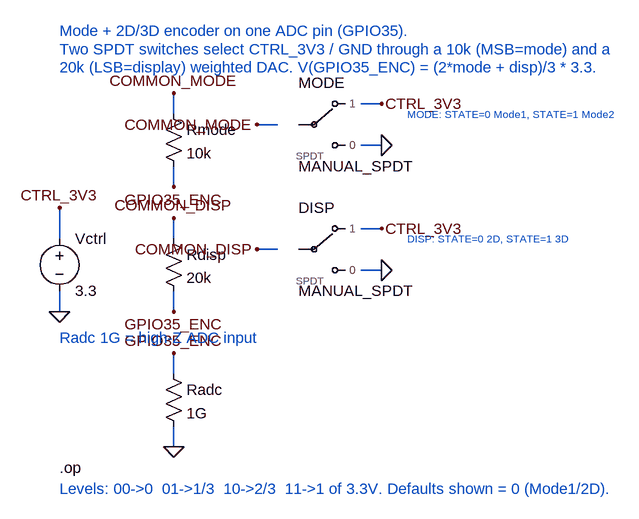
[diagram p0: schematic mode_encoder.asc]
mode_encoder.asc, the LTspice schematic file:
Version 4
SHEET 1 880 760
WIRE -160 160 -160 208
WIRE -160 288 -160 320
WIRE 16 -16 16 16
WIRE 16 96 16 128
WIRE 16 208 16 176
WIRE 16 288 16 320
WIRE 16 416 16 384
WIRE 16 496 16 528
WIRE 144 32 176 32
WIRE 144 224 176 224
WIRE 304 0 336 0
WIRE 304 64 336 64
WIRE 304 192 336 192
WIRE 304 256 336 256
FLAG -160 160 CTRL_3V3
FLAG -160 320 0
FLAG 16 -16 COMMON_MODE
FLAG 16 128 GPIO35_ENC
FLAG 16 176 COMMON_DISP
FLAG 16 320 GPIO35_ENC
FLAG 16 384 GPIO35_ENC
FLAG 16 528 0
FLAG 144 32 COMMON_MODE
FLAG 144 224 COMMON_DISP
FLAG 336 0 CTRL_3V3
FLAG 336 64 0
FLAG 336 192 CTRL_3V3
FLAG 336 256 0
SYMBOL voltage -160 192 R0
SYMATTR InstName Vctrl
SYMATTR Value 3.3
SYMBOL res 0 0 R0
SYMATTR InstName Rmode
SYMATTR Value 10k
SYMBOL res 0 192 R0
SYMATTR InstName Rdisp
SYMATTR Value 20k
SYMBOL res 0 400 R0
SYMATTR InstName Radc
SYMATTR Value 1G
SYMBOL MANUAL_SPDT 240 32 R0
SYMATTR InstName MODE
SYMATTR SpiceLine STATE=0
SYMBOL MANUAL_SPDT 240 224 R0
SYMATTR InstName DISP
SYMATTR SpiceLine STATE=0
TEXT -160 -112 Left 2 ;Mode + 2D/3D encoder on one ADC pin (GPIO35).
TEXT -160 -84 Left 2 ;Two SPDT switches select CTRL_3V3 / GND through a 10k (MSB=mode) and a
TEXT -160 -56 Left 2 ;20k (LSB=display) weighted DAC. V(GPIO35_ENC) = (2*mode + disp)/3 * 3.3.
TEXT 376 16 Left 1 ;MODE: STATE=0 Mode1, STATE=1 Mode2
TEXT 376 208 Left 1 ;DISP: STATE=0 2D, STATE=1 3D
TEXT -160 360 Left 2 ;Radc 1G = high-Z ADC input
TEXT -160 560 Left 2 !.op
TEXT -160 592 Left 2 ;Levels: 00->0  01->1/3  10->2/3  11->1 of 3.3V. Defaults shown = 0 (Mode1/2D).

The netlist it stands for:
* mode_encoder.asc
Vctrl CTRL_3V3 0 3.3
Rmode COMMON_MODE GPIO35_ENC 10k
Rdisp COMMON_DISP GPIO35_ENC 20k
Radc GPIO35_ENC 0 1G
XMODE COMMON_MODE CTRL_3V3 0 MANUAL_SPDT STATE=0  ; pins ? 1 0
XDISP COMMON_DISP CTRL_3V3 0 MANUAL_SPDT STATE=0  ; pins ? 1 0
* Mode + 2D/3D encoder on one ADC pin (GPIO35).
* Two SPDT switches select CTRL_3V3 / GND through a 10k (MSB=mode) and a
* 20k (LSB=display) weighted DAC. V(GPIO35_ENC) = (2*mode + disp)/3 * 3.3.
* MODE: STATE=0 Mode1, STATE=1 Mode2
* DISP: STATE=0 2D, STATE=1 3D
* Radc 1G = high-Z ADC input
.op
* Levels: 00->0  01->1/3  10->2/3  11->1 of 3.3V. Defaults shown = 0 (Mode1/2D).
.lib ManualSwitch.lib
.backanno
.end